# Altium project x4to1XTRXv13.PRJPCB
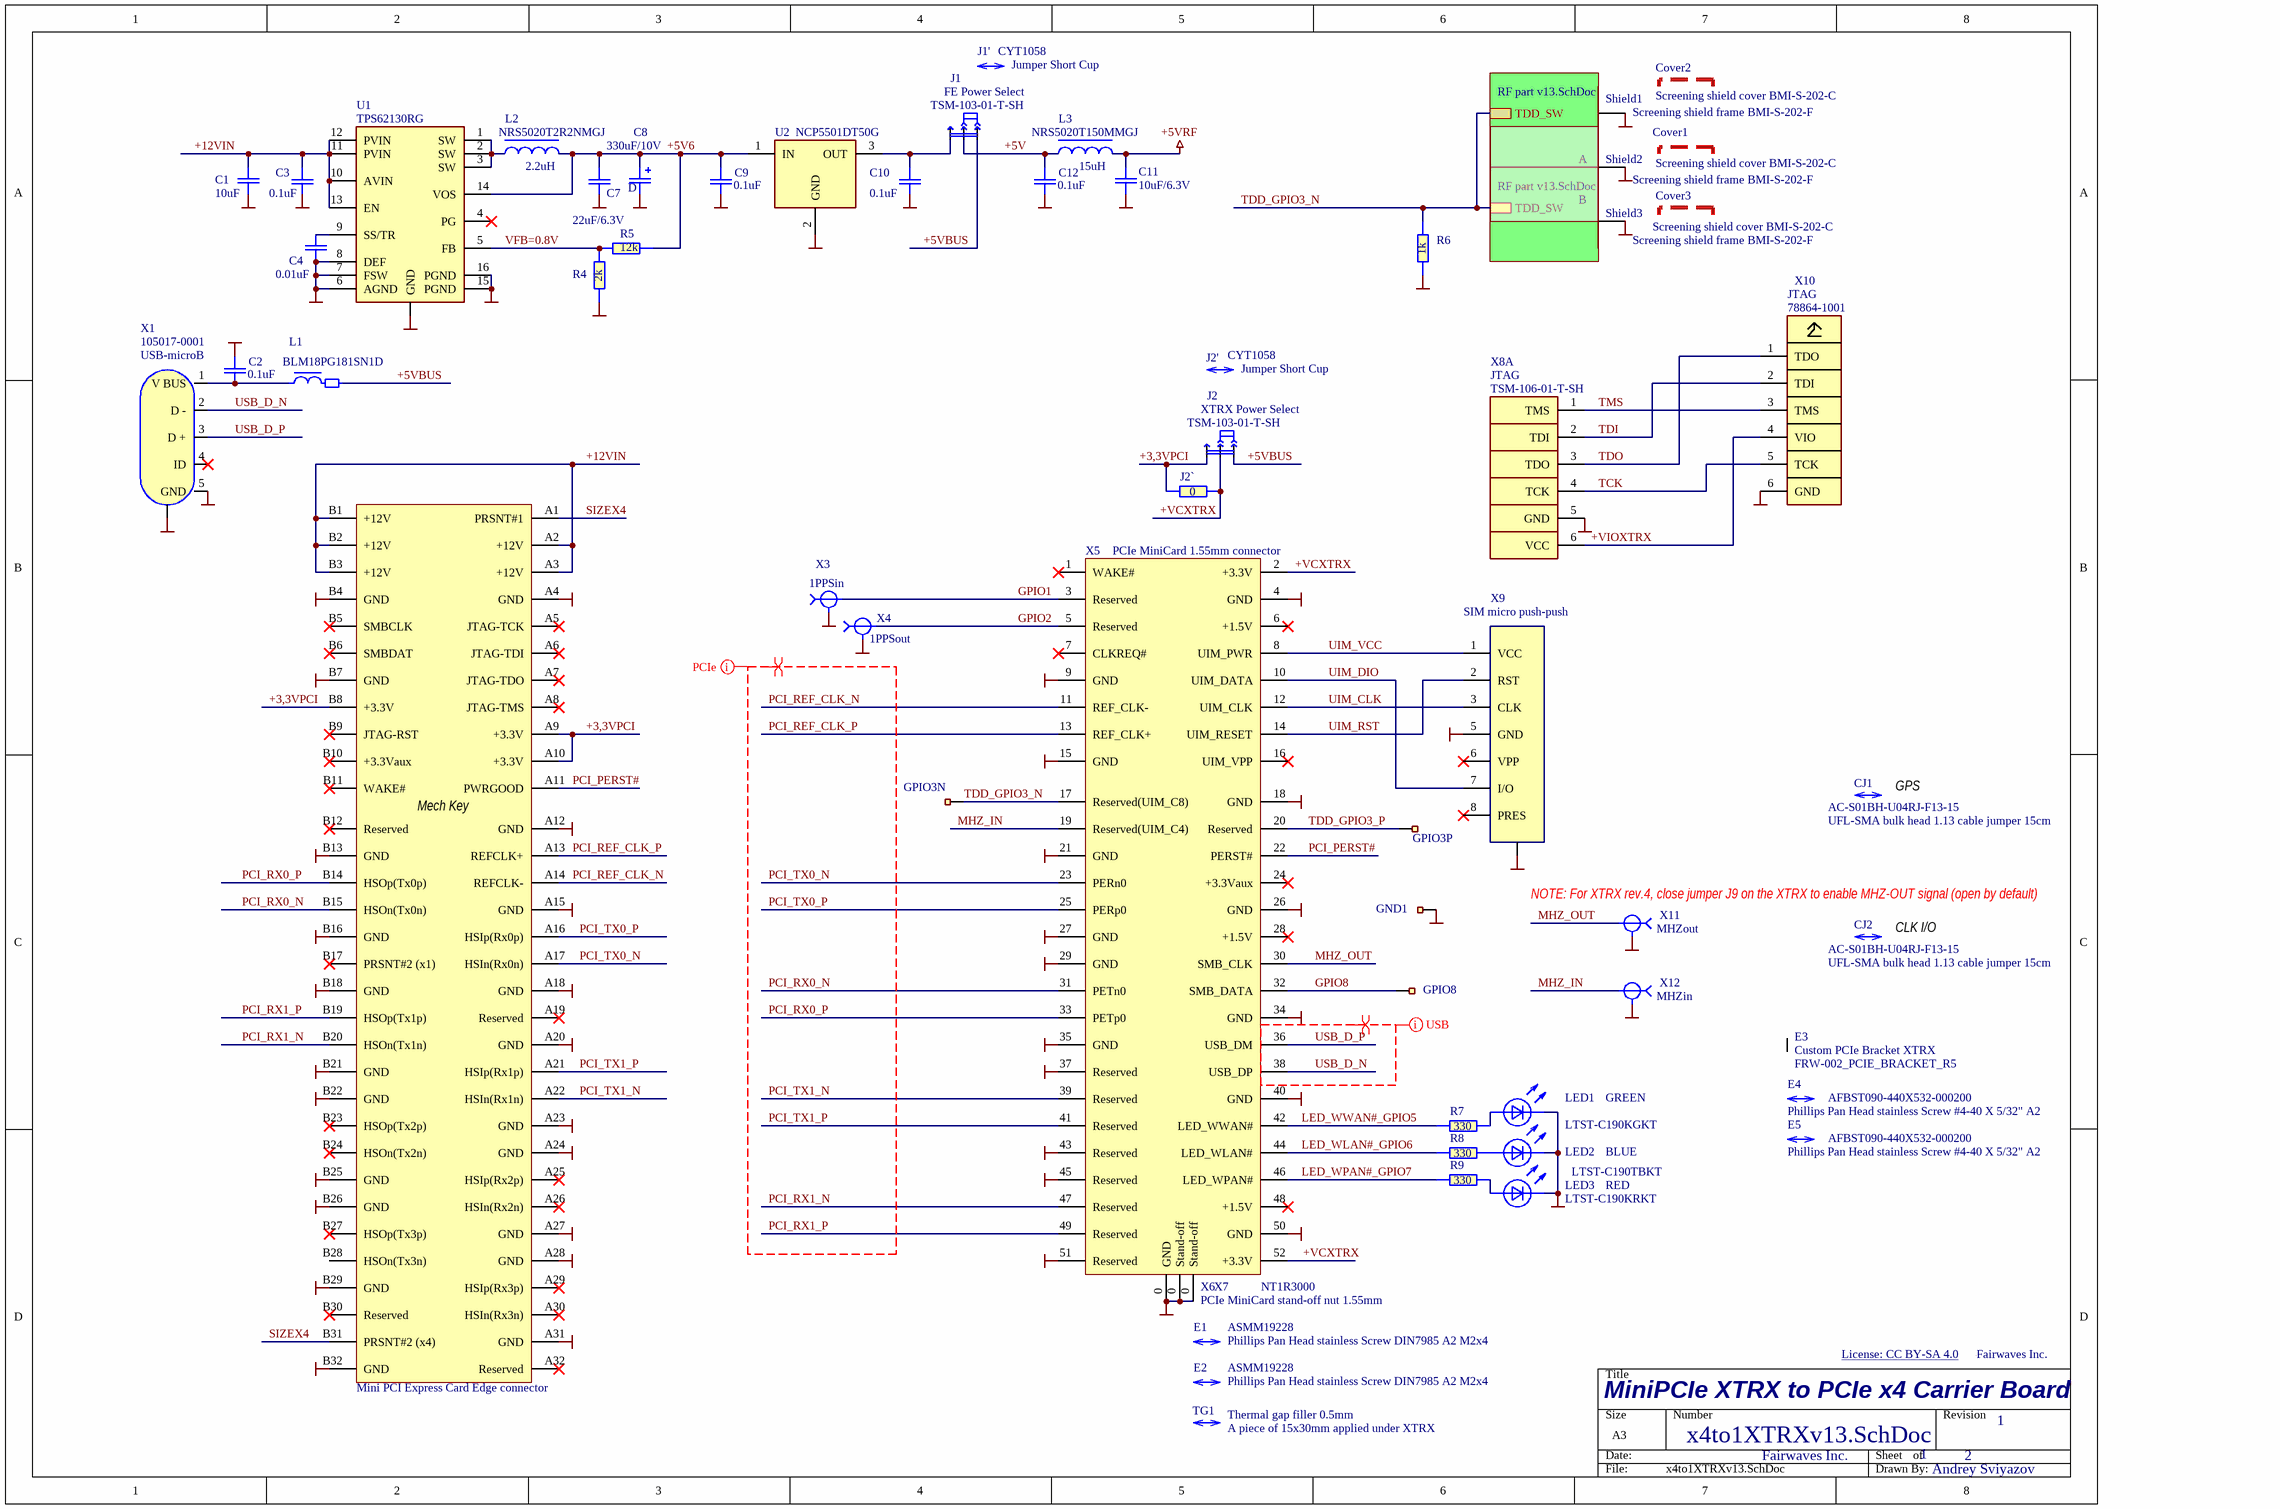
[diagram p0: x4to1XTRXv13.SchDoc]
RevisionNumber: 1
2 sheets, 118 parts. Net scope: hierarchical (ports join the sheet entries above them; power ports are global).
Board file: x4to1XTRXv13.PcbDoc
Sheets:
  x4to1XTRXv13.SchDoc
    A = RF part v13.SchDoc
    B = RF part v13.SchDoc

## Sheet x4to1XTRXv13.SchDoc: MiniPCIe XTRX to PCIe x4 Carrier Board
size A3; CompanyName: Fairwaves Inc.; DrawnBy: Andrey Sviyazov; Revision: 2; SheetNumber: 1; SheetTotal: 2; PageSetup: Record=PageOptions|CenterHorizontal=True|CenterVertical=True|PrintScale=1.04|XCorrection=1.00|YCorrection=1.00|PrintKind=0|BorderSize=5000000|LeftOffset=0|BottomOffset=0|Orientation=2|PaperLength=1000|PaperWidth=1000|Scale=100|PaperSource=7|PrintQuality=-3|MediaType=1|DitherType=10|PrintScaleMode=1|PaperKind=A3|PaperIndex=8

### Parts
C1  10uF  [C0805]
C2  0.1uF  [C0603-PHILLIPS]
C3  0.1uF  [C0603-PHILLIPS]
C4  0.01uF  [C0603-PHILLIPS]
C7  22uF/6.3V  [C0603-PHILLIPS]
C8  330uF/10V  [cd7343]
C9  0.1uF  [C0603-PHILLIPS]
C10  0.1uF  [C0603-PHILLIPS]
C11  10uF/6.3V  [C0603-Phillips]
C12  0.1uF  [C0603-PHILLIPS]
CJ1  AC-S01BH-U04RJ-F13-15  Misc: UFL-SMA bulk head 1.13 cable jumper 15cm  (mechanical)
CJ2  AC-S01BH-U04RJ-F13-15  Misc: UFL-SMA bulk head 1.13 cable jumper 15cm  (mechanical)
Cover1  Screening shield cover BMI-S-202-C  (mechanical)
Cover2  Screening shield cover BMI-S-202-C  (mechanical)
Cover3  Screening shield cover BMI-S-202-C  (mechanical)
E1  ASMM19228  Misc: Phillips Pan Head stainless Screw DIN7985 A2 M2x4  (mechanical)
E2  ASMM19228  Misc: Phillips Pan Head stainless Screw DIN7985 A2 M2x4  (mechanical)
E3  Custom PCIe Bracket XTRX  value FRW-002_PCIE_BRACKET_R5  [Custom_PCIe_bracket_XTRX1]
E4  AFBST090-440X532-000200  Misc: Phillips Pan Head stainless Screw #4-40 X 5/32" A2  (mechanical)
E5  AFBST090-440X532-000200  Misc: Phillips Pan Head stainless Screw #4-40 X 5/32" A2  (mechanical)
GND1  (no value)  [KP-C_d1mm]  (no BOM)
GPIO3N  (no value)  [KP-C_d1mm]  (no BOM)
GPIO3P  (no value)  [KP-C_d1mm]  (no BOM)
GPIO8  (no value)  [KP-C_d1mm]  (no BOM)
J1  TSM-103-01-T-SH  value FE Power Select  [Head_Male_3P_R/A_SMD]
J1'  CYT1058  (mechanical)
J2  TSM-103-01-T-SH  value XTRX Power Select  [Head_Male_3P_R/A_SMD]
J2'  CYT1058  (mechanical)
J2`  0  [R0603-PHILLIPS]
L1  BLM18PG181SN1D  [TI160808-Phillips]
L2  2.2uH  Name: NRS5020T2R2NMGJ  [L-NRS5030]
L3  15uH  Name: NRS5020T150MMGJ  [L-NRS5030]
LED1  LTST-C190KGKT  value GREEN  [LED-0603GR]
LED2  LTST-C190TBKT  value BLUE  [LED-0603BL]
LED3  LTST-C190KRKT  value RED  [LED-0603RD]
LOGO1  Fairwaves Inc.  [Logo Fairwaves]  (no BOM)
R4  2k  [R0603-PHILLIPS]
R5  12k  [R0603-PHILLIPS]
R6  1k  [R0603-PHILLIPS]
R7  330  [R0603-PHILLIPS]
R8  330  [R0603-PHILLIPS]
R9  330  [R0603-PHILLIPS]
Shield1  Screening shield frame BMI-S-202-F  [BMI-S-202-F]
Shield2  Screening shield frame BMI-S-202-F  [BMI-S-202-F]
Shield3  Screening shield frame BMI-S-202-F  [BMI-S-202-F]
TG1  A piece of 15x30mm applied under XTRX  Misc: Thermal gap filler 0.5mm  (mechanical)
U1  TPS62130RG  [QFN16(3x3/0/5mm)-Case485AE]
U2  NCP5501DT50G  [DPAK-3]
X1  105017-0001  Name: USB-microB  [USB-micro-B]
X2  Mini PCI Express Card Edge connector  [PCIe x4 edge connector]  (no BOM)
X3  Misc: 1PPSin  [U_FL]  (hidden comment: 0734120110)
X4  Misc: 1PPSout  [U_FL]  (hidden comment: 0734120110)
X5  PCIe MiniCard 1.55mm connector  [PCIe MiniCard 1.55mm conn]
X6  NT1R3000  Misc: PCIe MiniCard stand-off nut 1.55mm  [PCIe MiniCard 1.55mm stand off nut]
X7  NT1R3000  [PCIe MiniCard 1.55mm stand off nut]  (value not drawn)
X8  TSM-106-01-T-SH  value JTAG  [Head_Male_6P_R/A_SMD]  (parts A,B,C,D,E,F of 6)
X9  SIM micro push-push  [SIM_SF56S006V4BR2000-dig]
X10  JTAG  Name: 78864-1001  [Molex 78864-1001]
X11  Misc: MHZout  [U_FL]  (hidden comment: 0734120110)
X12  Misc: MHZin  [U_FL]  (hidden comment: 0734120110)

### Sub-sheets
A = RF part v13.SchDoc: TDD_SW
B = RF part v13.SchDoc: TDD_SW

### Nets
+5VRF: C11.2 L3.2
GND: C1.2 C2.2 C3.1 C4.2 C7.1 C8.2(-) C9.1 C10.1 C11.1 C12.1 GND1.1 LED1.1(K) LED2.1(K) LED3.1(K) R4.2 R6.1 Shield1.0(GND) Shield2.0(GND) Shield3.0(GND) U1.0(GND) U1.6(AGND) U1.7(FSW) U1.8(DEF) U1.15(PGND) U1.16(PGND) U2.2(GND) X1.0(GND) X1.5(GND) X2.A4(GND) X2.A12(GND) X2.A15(GND) X2.A18(GND) X2.A20(GND) X2.A23(GND) X2.A24(GND) X2.A27(GND) X2.A28(GND) X2.A31(GND) X2.B4(GND) X2.B7(GND) X2.B13(GND) X2.B16(GND) X2.B18(GND) X2.B21(GND) X2.B22(GND) X2.B25(GND) X2.B26(GND) X2.B29(GND) X2.B32(GND) X3.2(GND) X4.2(GND) X5.0(GND) X5.4(GND) X5.9(GND) X5.15(GND) X5.18(GND) X5.21(GND) X5.26(GND) X5.27(GND) X5.29(GND) X5.34(GND) X5.35(GND) X5.37(Reserved) X5.40(GND) X5.43(Reserved) X5.45(Reserved) X5.50(GND) X5.51(Reserved) X6.0(Stand-off) X7.0(Stand-off) X8.5(GND) X9.0(GND) X9.5(GND) X10.6(GND) X11.2(GND) X12.2(GND)
+3,3VPCI: J2.3 J2`.1 X2.A9(+3.3V) X2.A10(+3.3V) X2.B8(+3.3V)
+5V: C12.2 J1.2 L3.1
+5V6: C7.2 C8.1(+) C9.2 L2.2 R5.2 U1.14(VOS) U2.1(IN)
+5VBUS: J1.1 J2.1 L1.2
+12VIN: C1.1 C3.2 U1.10(AVIN) U1.11(PVIN) U1.12(PVIN) U1.13(EN) X2.A2(+12V) X2.A3(+12V) X2.B1(+12V) X2.B2(+12V) X2.B3(+12V)
+VCXTRX: J2.2 J2`.2 X5.2(+3.3V) X5.52(+3.3V)
+VIOXTRX: X8.6(VCC) X10.4(VIO)
GPIO1: X3.1 X5.3(Reserved)
GPIO2: X4.1 X5.5(Reserved)
GPIO8: GPIO8.1 X5.32(SMB_DATA)
LED_WLAN#_GPIO6: R8.1 X5.44(LED_WLAN#)
LED_WPAN#_GPIO7: R9.1 X5.46(LED_WPAN#)
LED_WWAN#_GPIO5: R7.1 X5.42(LED_WWAN#)
MHZ_IN: X5.19(Reserved(UIM_C4)) X12.1
MHZ_OUT: X5.30(SMB_CLK) X11.1
PCI_PERST#: X2.A11(PWRGOOD) X5.22(PERST#)
PCI_REF_CLK_N: X2.A14(REFCLK-) X5.11(REF_CLK-)
PCI_REF_CLK_P: X2.A13(REFCLK+) X5.13(REF_CLK+)
PCI_RX0_N: X2.B15(HSOn(Tx0n)) X5.31(PETn0)
PCI_RX0_P: X2.B14(HSOp(Tx0p)) X5.33(PETp0)
PCI_RX1_N: X2.B20(HSOn(Tx1n)) X5.47(Reserved)
PCI_RX1_P: X2.B19(HSOp(Tx1p)) X5.49(Reserved)
PCI_TX0_N: X2.A17(HSIn(Rx0n)) X5.23(PERn0)
PCI_TX0_P: X2.A16(HSIp(Rx0p)) X5.25(PERp0)
PCI_TX1_N: X2.A22(HSIn(Rx1n)) X5.39(Reserved)
PCI_TX1_P: X2.A21(HSIp(Rx1p)) X5.41(Reserved)
SIZEX4: X2.A1(PRSNT#1) X2.B31(PRSNT#2_(x4))
TCK: X8.4(TCK) X10.5(TCK)
TDD_GPIO3_N: GPIO3N.1 R6.2 X5.17(Reserved(UIM_C8)) ; sheet A/TDD_SW, sheet B/TDD_SW
TDD_GPIO3_P: GPIO3P.1 X5.20(Reserved)
TDI: X8.2(TDI) X10.2(TDI)
TDO: X8.3(TDO) X10.1(TDO)
TMS: X8.1(TMS) X10.3(TMS)
UIM_CLK: X5.12(UIM_CLK) X9.3(CLK)
UIM_DIO: X5.10(UIM_DATA) X9.7(I/O)
UIM_RST: X5.14(UIM_RESET) X9.2(RST)
UIM_VCC: X5.8(UIM_PWR) X9.1(VCC)
USB_D_N: X1.2(D_-) X5.38(USB_DP)
USB_D_P: X1.3(D_+) X5.36(USB_DM)
NetC2_1: C2.1 L1.1 X1.1(V_BUS)
NetC4_1: C4.1 U1.9(SS/TR)
NetC10_2: C10.2 J1.3 U2.3(OUT)
NetL2_1: L2.1 U1.1(SW) U1.2(SW) U1.3(SW)
NetLED1_2: LED1.2(A) R7.2
NetLED2_2: LED2.2(A) R8.2
NetLED3_2: LED3.2(A) R9.2
NetR4_1: R4.1 R5.1 U1.5(FB)

Not connected (* = marked no-connect by the designer): CJ1 ?1; CJ2 ?1; E1 ?1; E2 ?1; E3 0; E4 ?1; E5 ?1; J1' ?1; J2' ?1; LOGO1 1; TG1 ?1; U1 4(PG)*; X1 4(ID)*; X2 A5(JTAG-TCK)* A6(JTAG-TDI)* A7(JTAG-TDO)* A8(JTAG-TMS)* A19(Reserved)* A25(HSIp(Rx2p))* A26(HSIn(Rx2n))* A29(HSIp(Rx3p))* A30(HSIn(Rx3n))* A32(Reserved)* B5(SMBCLK)* B6(SMBDAT)* B9(JTAG-RST)* B10(+3.3Vaux)* B11(WAKE#)* B12(Reserved)* B17(PRSNT#2_(x1))* B23(HSOp(Tx2p))* B24(HSOn(Tx2n))* B27(HSOp(Tx3p))* B28(HSOn(Tx3n)) B30(Reserved)*; X5 1(WAKE#)* 6(+1.5V)* 7(CLKREQ#)* 16(UIM_VPP)* 24(+3.3Vaux)* 28(+1.5V)* 48(+1.5V)*; X9 6(VPP)* 8(PRES)*

### Layout directives
differential pair: PCI_REF_CLK_N, PCI_REF_CLK_P, PCI_RX0_N, PCI_RX0_P, PCI_RX1_N, PCI_RX1_P, PCI_TX0_N, PCI_TX0_P, PCI_TX1_N, PCI_TX1_P, USB_D_N, USB_D_P
net class PCIe: PCI_REF_CLK_N, PCI_REF_CLK_P, PCI_RX0_N, PCI_RX0_P, PCI_RX1_N, PCI_RX1_P, PCI_TX0_N, PCI_TX0_P, PCI_TX1_N, PCI_TX1_P
net class USB: USB_D_N, USB_D_P

### Notes on the sheet
- VFB=0.8V
- (near CJ1) GPS
- NOTE: For XTRX rev.4, close jumper J9 on the XTRX to enable MHZ-OUT signal (open by default)
- (near CJ2) CLK I/O
- (near LOGO1) License: CC BY-SA 4.0 <https://creativecommons.org/licenses/by-sa/4.0/>
- (in symbol CD7343) D
- (in symbol PCIe x4 Card) Mech Key

### Library data of the parts
C1 = C0805: Capacitor; Manufacturer: MURATA; Tolerance: 20%; Name: SMD0805; U/P/TKE: X5R/16V; Value: 10uF; Link: https://octopart.com/search?start=0&sort=avg_price&sort-dir=asc&category_ids=6332&specs.capacitance.value=1e-05&specs.voltage_rating_dc.value=25&avg_avail=(1__*)&specs.case_package_si.value=2012
C2-C4 C9 C10 C12 = C0603: Capacitor; Manufacturer: MURATA; Tolerance: 20%; Name: SMD0603; U/P/TKE: X7R
  C2 C3 C9 C10 C12: Value: 0.1uF
  C4: Value: 0.01uF
C7 = C0603: Capacitor; Manufacturer: MURATA; Tolerance: 20%; Name: SMD0603; U/P/TKE: X5R/6.3V; Value: 22uF/6.3V; Link: https://octopart.com/grm188r60j226mea0d-murata-21407286
C8 = CD7343: Capacitor; Manufacturer: Kemet; Name: CASE-D; U/P/TKE: 10V; Link: https://octopart.com/search?q=330uF+10V+tantalum+D; Value: 330uF/10V
C11 = C0603: Capacitor; Manufacturer: MURATA; Tolerance: 20%; Name: SMD0603; U/P/TKE: Y5V; Value: 10uF/6.3V; Link: https://octopart.com/search?q=0603+10uF+6.3v
CJ1 CJ2 = Mating part: Cable jumper; Manufacturer: RFSupplier; Name: AC-S01BH-U04RJ-F13-15; Link: https://rfsupplier.com/sma-female-to-ipex-ufl-connector-cable-with-rg113-cbale_p6418.html
Cover1-Cover3 = Screen cover BMI-S-202-C: Screening shield cover; Manufacturer: Laird Tech; Name: Screening shield cover BMI-S-202-C; Link: https://octopart.com/bmi-s-202-c-laird-19008953
E1 E2 = Mating subpart 1: Screw M2; Manufacturer: Aspen Fasteners; Name: ASMM19228; Link: https://www.amazon.com/dp/B00BNCAFR2/ref=cm_sw_r_cp_ep_dp_pCFuBbPAM8QH4
E3 = PCI_Bracket_XTRX1: CNC'ed enclosure component; Name: Custom PCIe Bracket XTRX; Link: https://drive.google.com/drive/u/0/folders/1H4kDKzo1hdiNwqkA16l54XGZ7OmraAuD
E4 E5 = Mating subpart 1: Screw #4-40; Manufacturer: Aspen Fasteners; Name: AFBST090-440X532-000200; Link: https://www.amazon.com/dp/B019EEPRJQ/ref=cm_sw_r_cp_ep_dp_erIuBbK2SDENX
GND1 GPIO3N GPIO3P GPIO8 = KP40X40: Manufacturer: PCB
J1 J2 = JUMPER_3P R/A SMD: Jumper 3 pin; Manufacturer: Samtec; Misc: SMT 3pin R/A jumper/connector; Name: TSM-103-01-T-SH; Link: https://octopart.com/tsm-103-01-t-sh-samtec-8024795?r=sp&s=QwI2rG3eQKmfzGqx_DrZCQ
J1' J2' = Mating part: Jumper Short Cup; Name: CYT1058; Link: https://www.amazon.com/dp/B06X1FFLMR/ref=sspa_dk_detail_0?psc=1&pd_rd_i=B06X1FFLMR&pd_rd_wg=glUhP&pd_rd_r=7KQW9WJBAB1TXMG7AV38&pd_rd_w=YmwM8; Misc: Jumper Short Cup
J2` = R0603: Jumper; Manufacturer: YAGEO; Tolerance: 1%; Name: SMD0603; U/P/TKE: 0.1W; Value: 0
L1 = EMI_BLM18: Ferrite Bead EMIFIL; Manufacturer: MURATA; U/P/TKE: 180 Ohm, 90 mOhm,1.5A; Name: BLM18PG181SN1D; Link: https://octopart.com/blm18pg181sn1d-murata-755298?r=sp&s=UoqSqWT2SxaJq0Sn2mx1DQ
L2 = L-NRS50x0: Coil; Manufacturer: Taiyo Yuden; Tolerance: 20%; U/P/TKE: 2.9A/42mOhm; Value: 2.2uH; Link: https://octopart.com/nrs5020t150mmgj-taiyo+yuden-13146350
L3 = L-NRS50x0: Coil; Manufacturer: Taiyo Yuden; Tolerance: 20%; U/P/TKE: 1.1A/165mOhm; Value: 15uH; Link: https://octopart.com/nrs5020t150mmgj-taiyo+yuden-13146350
LED1 = LED0603GR_Lite-On: LED GREEN; Manufacturer: Lite-On Inc; U/P/TKE: 40mcd, 2V/20mA, -30+85°C; Name: LTST-C190KGKT; Link: https://octopart.com/ltst-c190kgkt-lite-on-549897
LED2 = LED0603BU_Lite-On: LED BLUE; Manufacturer: Lite-On Inc; U/P/TKE: 100mcd, 3.3V/20mA, -20+80°C; Name: LTST-C190TBKT; Link: http://www.digikey.com/product-detail/en/LTST-C190TBKT/160-1646-1-ND/573586
LED3 = LED0603RD_Lite-On: LED RED; Manufacturer: Lite-On Inc; U/P/TKE: 100mcd, 2V/20mA, -30+85°C; Name: LTST-C190KRKT; Link: http://www.digikey.com/product-detail/en/LTST-C190KRKT/160-1436-1-ND/386816
LOGO1 = Logo Fairwaves: Name: Fairwaves Inc.; Misc: *
R4-R9 = R0603: Resistor; Manufacturer: YAGEO; Tolerance: 1%; Name: SMD0603; U/P/TKE: 0.1W
  R4: Value: 2k
  R5: Value: 12k
  R6: Value: 1k
  R7-R9: Value: 330
Shield1-Shield3 = Screen frame BMI-S-202-F: Screening shield frame; Manufacturer: Laird Tech; Name: Screening shield frame BMI-S-202-F; Link: https://octopart.com/bmi-s-202-f-laird-19008954
TG1 = Mating subpart 1: Thermal gap filler; Manufacturer: Wakefield; Name: PL-05-5-1016-H; Link: https://octopart.com/pl-05-5-1016-h-wakefield-80458840; Value: A piece of 15x30mm applied under XTRX
U1 = TPS6213x: IC; Manufacturer: TI; Swap: No; U/P/TKE: 3-17V; Name: TPS62130RG; Link: https://octopart.com/search?q=tps62130rg; PDF: http://www.ti.com/lit/ds/symlink/tps62130.pdf
U2 = NCP5501DTxxG: IC LDO fixed Vo; Manufacturer: ON Semi; U/P/TKE: 5.0V/0.5A/3%; Name: NCP5501DT50G; Link: https://octopart.com/ncp5501dt50g-on+semiconductor-1008548?r=sp&s=uWahieJ2SIu9_CpFmEZfrA
X1 = USB-microB_105017-1: Connector microUSB-B; Manufacturer: MOLEX; Value: 105017-0001; Link: https://octopart.com/1050170001-molex-11866487?r=sp&s=Om3EEUYtRd-BHyhqotd9rA
X2 = PCIe x4 Card: PCIe x4 Card edge connector
X3 X4 X11 X12 = U_FL: Connector (UMCC); Manufacturer: Molex; Name: 0734120110; Link: https://octopart.com/0734120110-molex-16756629
X5 = PCIe MiniCard conn h1.55mm: Connector PCIe MiniCard; Manufacturer: JAE Electronics; Name: MM60-52B1-G1; Link: https://octopart.com/mm60-52b1-g1-r850-jae+electronics-19499790
X6 = PCIe MiniCard nut h1.55mm: Stand-off nut PCIe MiniCard; Manufacturer: JAE Electronics; Link: https://octopart.com/nt1r3000-jae+electronics-19043816; Name: NT1R3000
X7 = PCIe MiniCard nut h1.55mm: Stand-off nut PCIe MiniCard; Manufacturer: JAE Electronics; Misc: PCIe MiniCard stand-off nut 1.55mm; Link: https://octopart.com/nt1r3000-jae+electronics-19043816; Name: NT1R3000
X8 = Conn TSM-106-01-T-SH (=M20-89605): Connector header male; Manufacturer: Samtec; Name: TSM-106-01-T-SH; Link: https://octopart.com/tsm-106-01-t-sh-samtec-8444065?r=sp&s=4nKo29egTCGXCLlTpUf1dA
X9 = SIM micro push-push: Connector SIM micro card; Manufacturer: JAE; Value: SF56S006V4BR2000; Link: https://octopart.com/sf56s006v4br2000-jae+electronics-55772495?r=sp&s=RZW5_ItfTZ2wF5MtOkXdLQ; Misc: *
X10 = Conn Molex_788641001: Connector board to board; Manufacturer: Molex; Misc: Connector board to board, 6 spring contacts; Value: JTAG; Link: https://octopart.com/78864-1001-molex-52668680?r=sp&s=CalIQCkHRmWKRIBINWJXJg

## Sheet RF part v13.SchDoc: MiniPCIe XTRX to PCIe x4 Carrier Board
size A4 portrait; CompanyName: Fairwaves Inc; DrawnBy: Andrey Sviyazov; Revision: 2; SheetNumber: 2; SheetTotal: 2
Used 2 times, as channels A, B. Parts and nets are listed once, with the designators drawn on the sheet.
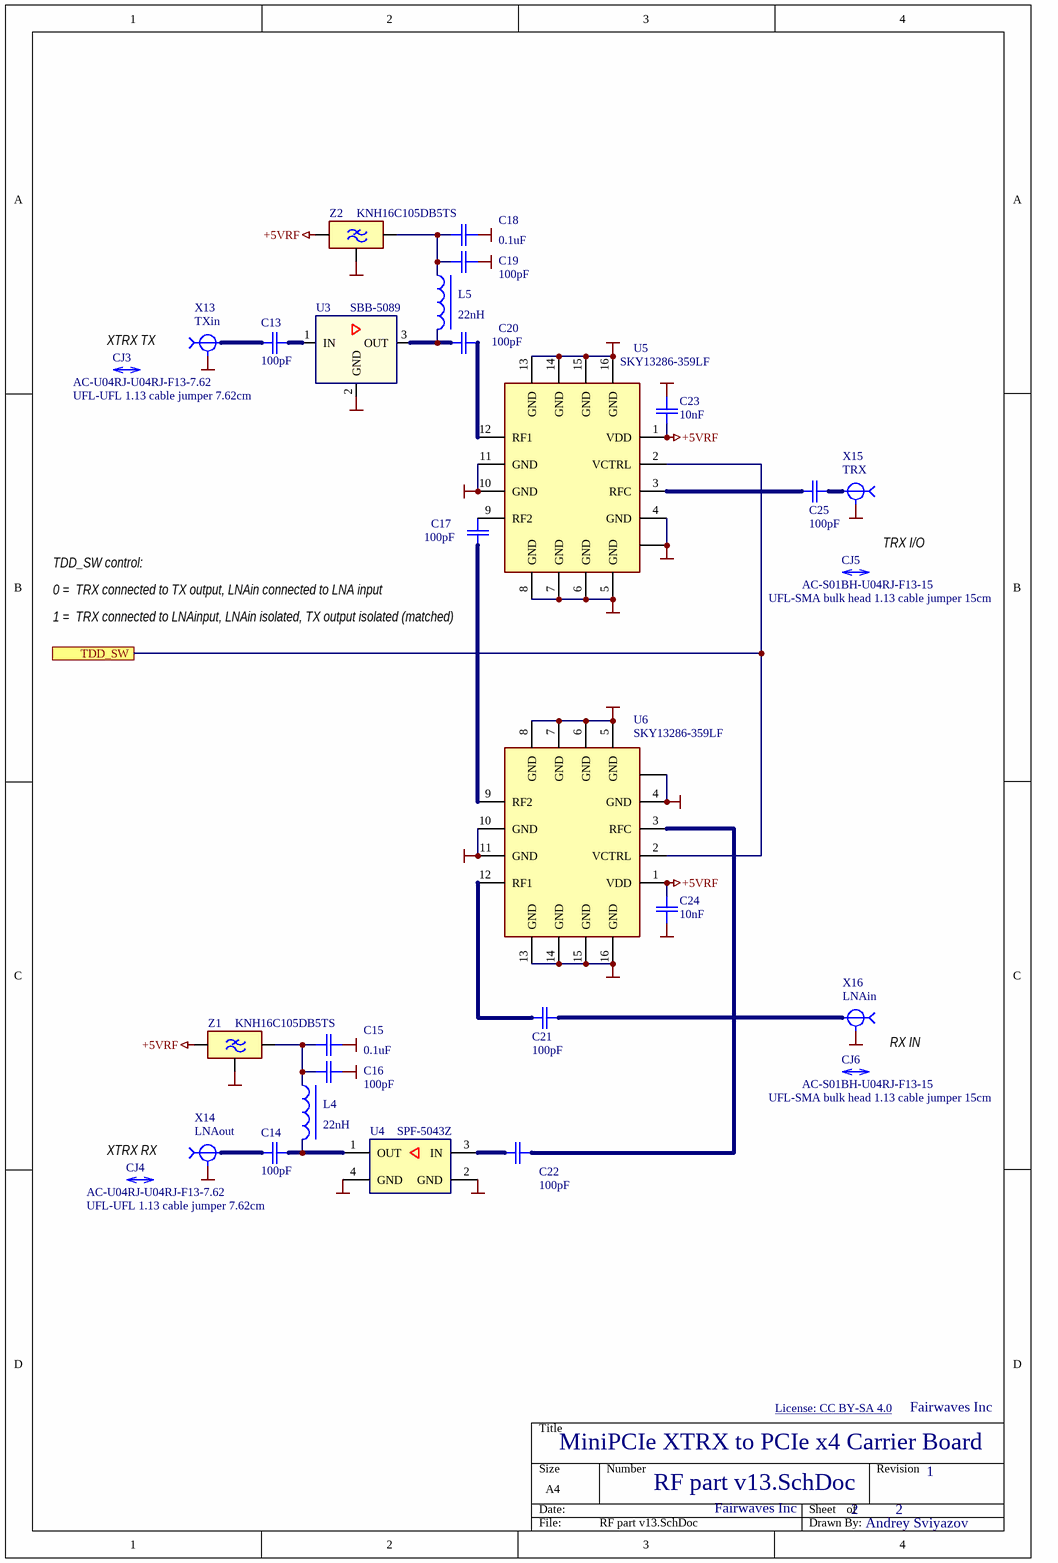
[diagram p1: RF part v13.SchDoc]

### Parts
C13  100pF  [C0603-PHILLIPS]
C14  100pF  [C0603-PHILLIPS]
C15  0.1uF  [C0603-PHILLIPS]
C16  100pF  [C0603-PHILLIPS]
C17  100pF  [C0603-PHILLIPS]
C18  0.1uF  [C0603-PHILLIPS]
C19  100pF  [C0603-PHILLIPS]
C20  100pF  [C0603-PHILLIPS]
C21  100pF  [C0603-PHILLIPS]
C22  100pF  [C0603-PHILLIPS]
C23  10nF  [C0603-PHILLIPS]
C24  10nF  [C0603-PHILLIPS]
C25  100pF  [C0603-PHILLIPS]
CJ3  AC-U04RJ-U04RJ-F13-7.62  Misc: UFL-UFL 1.13 cable jumper 7.62cm  (mechanical)
CJ4  AC-U04RJ-U04RJ-F13-7.62  Misc: UFL-UFL 1.13 cable jumper 7.62cm  (mechanical)
CJ5  AC-S01BH-U04RJ-F13-15  Misc: UFL-SMA bulk head 1.13 cable jumper 15cm  (mechanical)
CJ6  AC-S01BH-U04RJ-F13-15  Misc: UFL-SMA bulk head 1.13 cable jumper 15cm  (mechanical)
L4  22nH  [TF160808-Phillips]
L5  22nH  [TF160808-Phillips]
U3  SBB-5089  [SOT89]
U4  SPF-5043Z  [SOT-343[2X1.25]]
U5  SKY13286-359LF  [QFN16(4x4/0.65mm) SQ]
U6  SKY13286-359LF  [QFN16(4x4/0.65mm) SQ]
X13  Misc: TXin  [U_FL]  (hidden comment: 0734120110)
X14  Misc: LNAout  [U_FL]  (hidden comment: 0734120110)
X15  Misc: TRX  [U_FL]  (hidden comment: 0734120110)
X16  Misc: LNAin  [U_FL]  (hidden comment: 0734120110)
Z1  KNH16C105DB5TS  [KNH16 - DB Serie]
Z2  KNH16C105DB5TS  [KNH16 - DB Serie]

### Ports
TDD_SW

### Nets
+5VRF: C23.1 C24.1 U5.1(VDD) U6.1(VDD) Z1.1 Z2.1
GND: C15.2 C16.2 C18.2 C19.2 C23.2 C24.2 U3.2(GND) U4.2(GND) U4.4(GND) U5.0(PAD) U5.4(GND) U5.5(GND) U5.6(GND) U5.7(GND) U5.8(GND) U5.10(GND) U5.11(GND) U5.13(GND) U5.14(GND) U5.15(GND) U5.16(GND) U6.0(PAD) U6.4(GND) U6.5(GND) U6.6(GND) U6.7(GND) U6.8(GND) U6.10(GND) U6.11(GND) U6.13(GND) U6.14(GND) U6.15(GND) U6.16(GND) X13.2(GND) X14.2(GND) X15.2(GND) X16.2(GND) Z1.2 Z2.2
TDD_SW: U5.2(VCTRL) U6.2(VCTRL) ; port TDD_SW
NetC13_1: C13.1 X13.1
NetC13_2: C13.2 U3.1(IN)
NetC14_1: C14.1 X14.1
NetC14_2: C14.2 L4.2 U4.1(OUT)
NetC15_1: C15.1 C16.1 L4.1 Z1.3
NetC17_1: C17.1 U6.9(RF2)
NetC17_2: C17.2 U5.9(RF2)
NetC18_1: C18.1 C19.1 L5.1 Z2.3
NetC20_1: C20.1 L5.2 U3.3(OUT)
NetC20_2: C20.2 U5.12(RF1)
NetC21_1: C21.1 U6.12(RF1)
NetC21_2: C21.2 X16.1
NetC22_1: C22.1 U4.3(IN)
NetC22_2: C22.2 U6.3(RFC)
NetC25_1: C25.1 U5.3(RFC)
NetC25_2: C25.2 X15.1

Not connected (* = marked no-connect by the designer): CJ3 ?1; CJ4 ?1; CJ5 ?1; CJ6 ?1

### Channels
A: designators end in A; ports TDD_SW=TDD_GPIO3_N
B: designators end in B; ports TDD_SW=TDD_GPIO3_N

### Notes on the sheet
- (near CJ3) XTRX TX
- TDD_SW control:
- TRX I/O
- (near U5) 0 =  TRX connected to TX output, LNAin connected to LNA input
- (near U5) 1 =  TRX connected to LNAinput, LNAin isolated, TX output isolated (matched)
- RX IN
- (near CJ4) XTRX RX
- License: CC BY-SA 4.0 <https://creativecommons.org/licenses/by-sa/4.0/>

### Library data of the parts
C13 C14 C16 C17 C19-C22 C25 = C0603: Capacitor; Manufacturer: MURATA; Tolerance: 20%; Name: SMD0603; U/P/TKE: NP0; Value: 100pF
C15 C18 C23 C24 = C0603: as C2 on sheet x4to1XTRXv13
  C15 C18: Value: 0.1uF
  C23 C24: Value: 10nF
CJ3-CJ6 = Mating part: Cable jumper; Manufacturer: RFSupplier
  CJ3 CJ4: Name: AC-U04RJ-U04RJ-F13-7.62; Link: https://rfsupplier.com/customcable.html
  CJ5 CJ6: Name: AC-S01BH-U04RJ-F13-15; Link: https://rfsupplier.com/sma-female-to-ipex-ufl-connector-cable-with-rg113-cbale_p6418.html
L4 L5 = TF160808: Coil; Manufacturer: MuRata; Misc: Self Resonance >4GHz; Name: LQW18AN22NG00D; Value: 22nH; Link: https://octopart.com/lqw18an22ng00d-murata-890271
U3 = SBB-5089: IC; Manufacturer: RFMD; Misc: Gain Block; Swap: No; Name: SBB-5089; Link: https://octopart.com/search?r=sp&s=Om3EEUYtRd-BHyhqotd9rA&q=sbb5089z&oq=SBB5089&start=0
U4 = SPF-5043Z: IC; Manufacturer: RFMD; Swap: No; Name: SPF-5043Z; Link: https://octopart.com/search?q=SPF+5043Z
U5 U6 = SKY13286-359LF: IC RF SPDT Absorptive Switch; Manufacturer: Skyworks; Misc: SPDT 0.1-6 GHz Hi Isol Absorptive Switch; Swap: No; U/P/TKE: 3-5V; Name: SKY13286-359LF; Link: https://octopart.com/sky13286-359lf-skyworks+solutions-3998422
X13-X16 = U_FL: Connector (UMCC); Manufacturer: Molex; Name: 0734120110; Link: https://octopart.com/0734120110-molex-16756629
Z1 Z2 = KNH16 Serie: EMI Filter; Manufacturer: AVX / Kyocera; Misc: Power line EMI Filter 0603 Size; Value: 1uF/10V/2A; Name: KNH16C105DB5TS; Link: https://octopart.com/knh16c105db5ts-avx-21214733

## Nets that join several sheets
+5VRF: x4to1XTRXv13 (C11.2 L3.2), A (6 pins), B (6 pins)
GND: x4to1XTRXv13 (76 pins), A (39 pins), B (39 pins)
TDD_GPIO3_N: x4to1XTRXv13 (GPIO3N.1 R6.2 X5.17), A (U5A.2 U6A.2), B (U5B.2 U6B.2)

## Assembly variants
Fully eqpt: not fitted J2`
Light variant: not fitted C1 C1 C2 C3 C3 C4 C4 C5 C6 C7 C7 C8 C9 C10 C11 C12 C13A C13B C14A C14B C15A C15B C16A C16B C17A C17B C18A C18B C19A C19B C20A C20B C21A C21B C22A C22B C23A C23B C24A C24B C25A C25B CJ3A CJ3B CJ4A CJ4B Cover1 Cover2 Cover3 D1 J1 J1' J2 J2' L1 L2 L2 L3 L4A L4B L5A L5B R1 R2 R3 R4 R4 R5 R5 R6 Shield1 Shield2 Shield3 U1 U1 U2 U3A U3B U4A U4B U5A U5B U6A U6B X1 X13A X13B X14A X14B X15A X15B X16A X16B Z1A Z1B Z2A Z2B